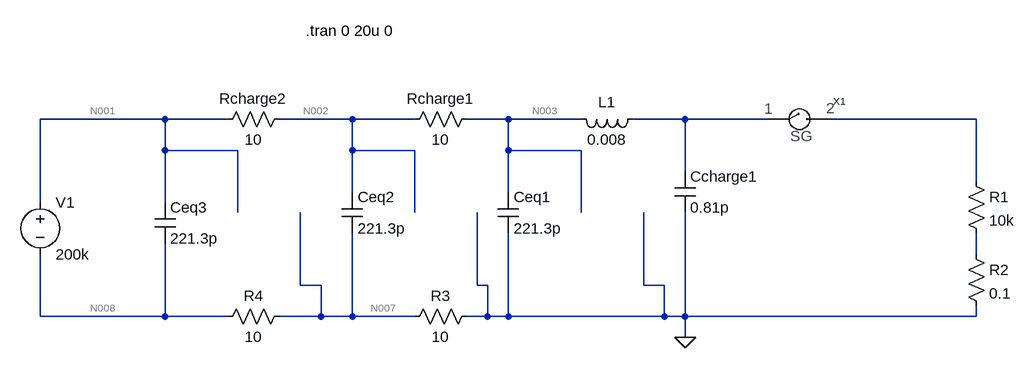
[diagram p0: schematic Draft2.asc]
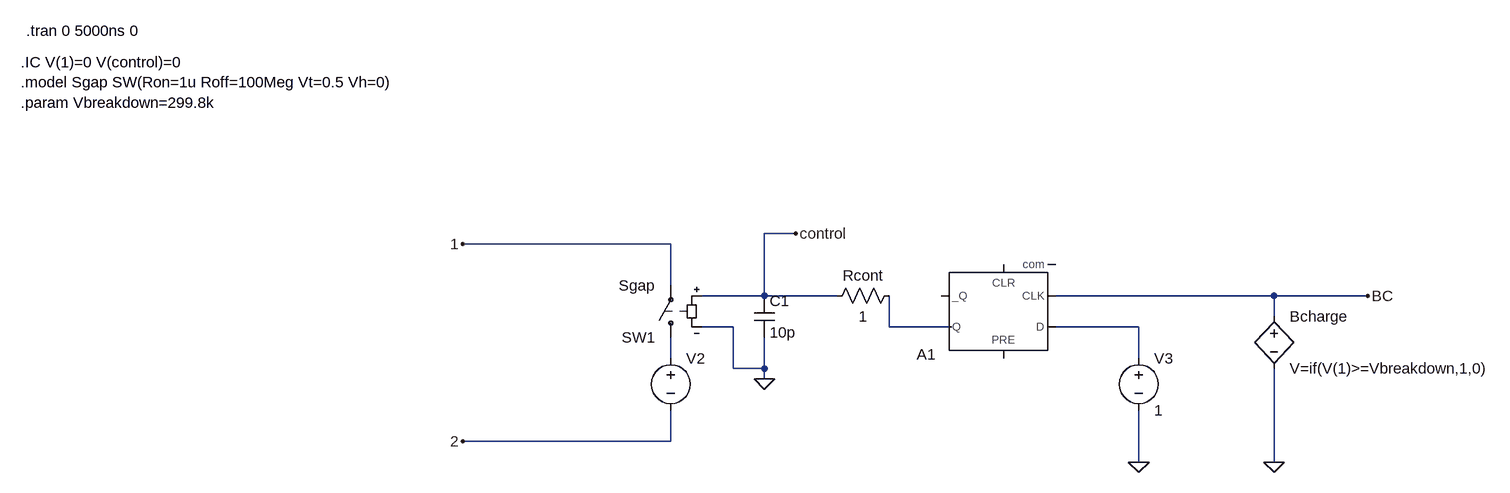
[diagram p1: sub-circuit sg_model.asc]
Draft2.asc, the LTspice schematic file:
Version 4
SHEET 1 2544 680
WIRE 192 -32 0 -32
WIRE 288 -32 192 -32
WIRE 480 -32 368 -32
WIRE 576 -32 480 -32
WIRE 720 -32 656 -32
WIRE 832 -32 720 -32
WIRE 992 -32 912 -32
WIRE 1120 -32 992 -32
WIRE 1440 -32 1216 -32
WIRE 192 16 192 -32
WIRE 304 16 192 16
WIRE 480 16 480 -32
WIRE 576 16 480 16
WIRE 720 16 720 -32
WIRE 832 16 720 16
WIRE 992 48 992 -32
WIRE 1440 64 1440 -32
WIRE 480 80 480 16
WIRE 720 80 720 16
WIRE 0 96 0 -32
WIRE 192 96 192 16
WIRE 304 112 304 16
WIRE 576 112 576 16
WIRE 832 112 832 16
WIRE 1440 176 1440 144
WIRE 400 224 400 112
WIRE 432 224 400 224
WIRE 672 224 672 112
WIRE 688 224 672 224
WIRE 928 224 928 112
WIRE 960 224 928 224
WIRE 0 272 0 176
WIRE 192 272 192 160
WIRE 192 272 0 272
WIRE 288 272 192 272
WIRE 432 272 432 224
WIRE 432 272 368 272
WIRE 480 272 480 144
WIRE 480 272 432 272
WIRE 576 272 480 272
WIRE 688 272 688 224
WIRE 688 272 656 272
WIRE 720 272 720 144
WIRE 720 272 688 272
WIRE 960 272 960 224
WIRE 960 272 720 272
WIRE 992 272 992 112
WIRE 992 272 960 272
WIRE 1440 272 1440 256
WIRE 1440 272 992 272
WIRE 992 304 992 272
FLAG 992 304 0
SYMBOL cap 976 48 R0
SYMATTR InstName Ccharge1
SYMATTR Value 0.81p
SYMBOL res 1424 48 R0
SYMATTR InstName R1
SYMATTR Value 10k
SYMBOL sg_model 1168 -32 R0
SYMATTR InstName X1
SYMBOL cap 704 80 R0
SYMATTR InstName Ceq1
SYMATTR Value 221.3p
SYMBOL res 672 -48 R90
WINDOW 0 0 56 VBottom 2
WINDOW 3 32 56 VTop 2
SYMATTR InstName Rcharge1
SYMATTR Value 10
SYMBOL res 1424 160 R0
SYMATTR InstName R2
SYMATTR Value 0.1
SYMBOL res 672 256 R90
WINDOW 0 0 56 VBottom 2
WINDOW 3 32 56 VTop 2
SYMATTR InstName R3
SYMATTR Value 10
SYMBOL cap 464 80 R0
SYMATTR InstName Ceq2
SYMATTR Value 221.3p
SYMBOL cap 176 96 R0
SYMATTR InstName Ceq3
SYMATTR Value 221.3p
SYMBOL res 384 -48 R90
WINDOW 0 0 56 VBottom 2
WINDOW 3 32 56 VTop 2
SYMATTR InstName Rcharge2
SYMATTR Value 10
SYMBOL res 384 256 R90
WINDOW 0 0 56 VBottom 2
WINDOW 3 32 56 VTop 2
SYMATTR InstName R4
SYMATTR Value 10
SYMBOL voltage 0 80 R0
SYMATTR InstName V1
SYMATTR Value 200k
SYMBOL ind 928 -48 R90
WINDOW 0 5 56 VBottom 2
WINDOW 3 32 56 VTop 2
SYMATTR InstName L1
SYMATTR Value 0.008
TEXT 408 -168 Left 2 !.tran 0 20u 0

sg_model.asc, the sub-circuit schematic file:
Version 4
SHEET 1 1600 680
WIRE 464 64 416 64
WIRE 272 80 -48 80
WIRE 272 144 272 80
WIRE 416 160 416 64
WIRE 416 160 320 160
WIRE 528 160 416 160
WIRE 1200 160 864 160
WIRE 1344 160 1200 160
WIRE 1200 192 1200 160
WIRE 368 208 320 208
WIRE 608 208 608 160
WIRE 704 208 608 208
WIRE 992 208 864 208
WIRE 272 256 272 224
WIRE 992 256 992 208
WIRE 368 272 368 208
WIRE 416 272 416 224
WIRE 416 272 368 272
WIRE 416 288 416 272
WIRE 272 384 272 336
WIRE 272 384 -48 384
WIRE 992 416 992 336
WIRE 1200 416 1200 272
FLAG 416 288 0
FLAG 992 416 0
FLAG 1200 416 0
FLAG 464 64 control
FLAG 1344 160 BC
FLAG -48 80 1
FLAG -48 384 2
SYMBOL voltage 992 240 R0
WINDOW 123 0 0 Left 0
WINDOW 39 0 0 Left 0
SYMATTR InstName V3
SYMATTR Value 1
SYMBOL voltage 272 240 R0
WINDOW 123 0 0 Left 0
WINDOW 39 24 44 Left 2
SYMATTR InstName V2
SYMATTR Value ""
SYMBOL res 624 144 R90
WINDOW 0 0 56 VBottom 2
WINDOW 3 32 56 VTop 2
SYMATTR InstName Rcont
SYMATTR Value 1
SYMBOL cap 400 160 R0
SYMATTR InstName C1
SYMATTR Value 10p
SYMBOL bv 1200 176 R0
SYMATTR InstName Bcharge
SYMATTR Value V=if(V(1)>=Vbreakdown,1,0)
SYMBOL Digital\\dflop 784 256 R180
SYMATTR InstName A1
SYMBOL sw 272 240 R180
SYMATTR InstName SW1
SYMATTR Value Sgap
TEXT -728 -200 Left 2 !.IC V(1)=0 V(control)=0\n.model Sgap SW(Ron=1u Roff=100Meg Vt=0.5 Vh=0)\n.param Vbreakdown=299.8k
TEXT -720 -248 Left 2 !.tran 0 5000ns 0

The netlist it stands for:
* Draft2.asc
Ccharge1 N004 0 0.81p
R1 N005 N006 10k
XX1 N004 N005 sg_model
Ceq1 N003 0 221.3p
Rcharge1 N003 N002 10
R2 N006 0 0.1
R3 0 N007 10
Ceq2 N002 N007 221.3p
Ceq3 N001 N008 221.3p
Rcharge2 N002 N001 10
R4 N007 N008 10
V1 N001 N008 200k
L1 N004 N003 0.008

* block symbol definitions
.subckt sg_model 1 2
V3 N002 0 1
V2 N003 2
Rcont N001 control 1
C1 control 0 10p
Bcharge BC 0 V=if(V(1)>=Vbreakdown,1,0)
A1 N002 0 BC 0 0 0 N001 0 DFLOP
SW1 N003 1 control 0 Sgap
.IC V(1)=0 V(control)=0
.model Sgap SW(Ron=1u Roff=100Meg Vt=0.5 Vh=0)
.param Vbreakdown=299.8k
.tran 0 5000ns 0
.ends sg_model

.tran 0 20u 0
.backanno
.end

* Results of the author's LTspice run, read from the files saved beside the schematic
* Operating Point, zero values left out:
*   V(n003) = 5 V
*   V(n002) = 50 kV
*   V(n007) = -50 kV
*   V(n001) = 100 kV
*   V(n008) = -100 kV
*   I(L1) = -5 kA
*   I(R4) = 5 kA
*   I(Rcharge2) = -5 kA
*   I(R3) = 5 kA
*   I(Rcharge1) = -5 kA
*   I(V1) = -5 kA
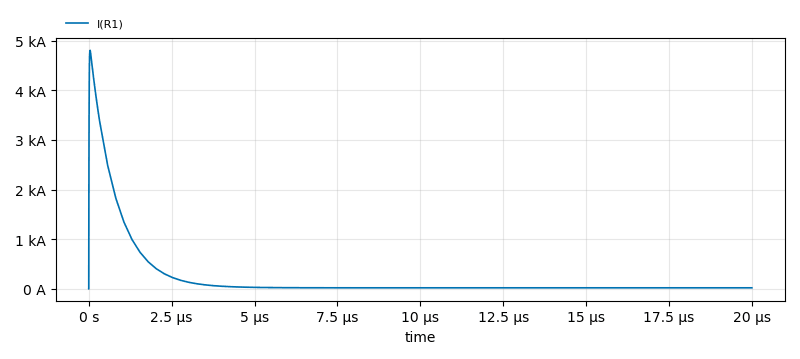
[diagram p2: Transient Analysis of Draft2.asc, plotted from the saved traces]
* Transient Analysis, 1 run:
*   I(R1): min 0 A, max 4.803 kA, average 219.3 A, rms 713.5 A, last 19.92 A